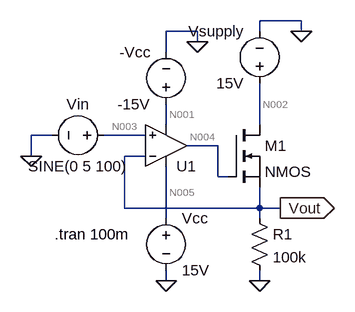
[diagram p0: schematic Q6.asc]
Q6.asc, the LTspice schematic file:
Version 4
SHEET 1 880 680
WIRE 336 -64 272 -64
WIRE 176 -48 128 -48
WIRE 272 -48 272 -64
WIRE 336 -48 336 -64
WIRE 176 -32 176 -48
WIRE 128 -16 128 -48
WIRE 128 96 128 64
WIRE 272 96 272 32
WIRE -48 112 -80 112
WIRE 96 112 32 112
WIRE 208 128 160 128
WIRE -80 144 -80 112
WIRE 96 144 64 144
WIRE 208 176 208 128
WIRE 224 176 208 176
WIRE 64 224 64 144
WIRE 272 224 272 192
WIRE 272 224 64 224
WIRE 304 224 272 224
WIRE 128 240 128 160
WIRE 272 240 272 224
WIRE 128 336 128 320
WIRE 272 336 272 320
FLAG 272 336 0
FLAG 176 -32 0
FLAG 128 336 0
FLAG 336 -48 0
FLAG -80 144 0
FLAG 304 224 Vout
IOPIN 304 224 Out
SYMBOL Opamps\\UniversalOpamp2 128 128 M180
SYMATTR InstName U1
SYMBOL nmos 224 96 R0
SYMATTR InstName M1
SYMBOL res 256 224 R0
SYMATTR InstName R1
SYMATTR Value 100k
SYMBOL voltage 128 80 R180
WINDOW 0 24 96 Left 2
WINDOW 3 24 16 Left 2
SYMATTR InstName -Vcc
SYMATTR Value -15V
SYMBOL voltage 128 224 R0
SYMATTR InstName Vcc
SYMATTR Value 15V
SYMBOL voltage 48 112 R90
WINDOW 0 -32 56 VBottom 2
WINDOW 3 32 56 VTop 2
WINDOW 123 0 0 Left 0
WINDOW 39 0 0 Left 0
SYMATTR InstName Vin
SYMATTR Value SINE(0 5 100)
SYMBOL voltage 272 48 R180
WINDOW 0 24 96 Left 2
WINDOW 3 24 16 Left 2
WINDOW 123 0 0 Left 0
WINDOW 39 0 0 Left 0
SYMATTR InstName Vsupply
SYMATTR Value 15V
TEXT -44 264 Left 2 !.tran 100m

The netlist it stands for:
* Q6.asc
XU1 N003 Vout N005 N001 N004 level.2 Avol=1Meg GBW=10Meg Slew=10Meg ilimit=25m rail=0 Vos=0 phimargin=45 en=0 enk=0 in=0 ink=0 Rin=500Meg  ; pins IN+ IN- V+ V- OUT
M1 N002 N004 Vout Vout NMOS
R1 Vout 0 100k
V§-Vcc N001 0 -15V
Vcc N005 0 15V
Vin N003 0 SINE(0 5 100)
Vsupply N002 0 15V
.model NMOS NMOS
.model PMOS PMOS
.lib standard.mos
.tran 100m
.lib UniversalOpamps2.sub
.backanno
.end

* Results of the author's LTspice run, read from the files saved beside the schematic
* Operating Point, zero values left out:
*   V(n004) = -2.995 V
*   V(n005) = 15 V
*   V(n001) = -15 V
*   V(vout) = 3 µV
*   V(n002) = 15 V
*   Id(M1) = 30.01 pA
*   Ib(M1) = -15.01 pA
*   Is(M1) = -15 pA
*   I(R1) = 30 pA
*   I(Vsupply) = -30.01 pA
*   I(Vcc) = -1.468 mA
*   I(-vcc) = 1.468 mA
*   Ix(u1:3) = 1.468 mA
*   Ix(u1:4) = -1.468 mA
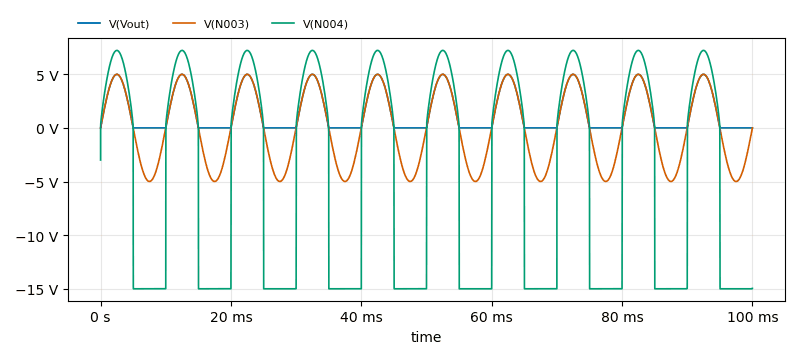
[diagram p1: Transient Analysis of Q6.asc, plotted from the saved traces]
* Transient Analysis, 1 run:
*   V(Vout): min 3 µV, max 4.994 V, average 1.588 V, rms 2.497 V, last 3 µV
*   V(N003): min -5 V, max 4.998 V, average 110.8 µV, rms 3.534 V, last 0 V
*   V(N004): min -15 V, max 7.228 V, average -5.061 V, rms 11.24 V, last -14.96 V